# Altium schematic sheet 21 MEMORY_POWER.SchDoc
size 871 x 579 mm
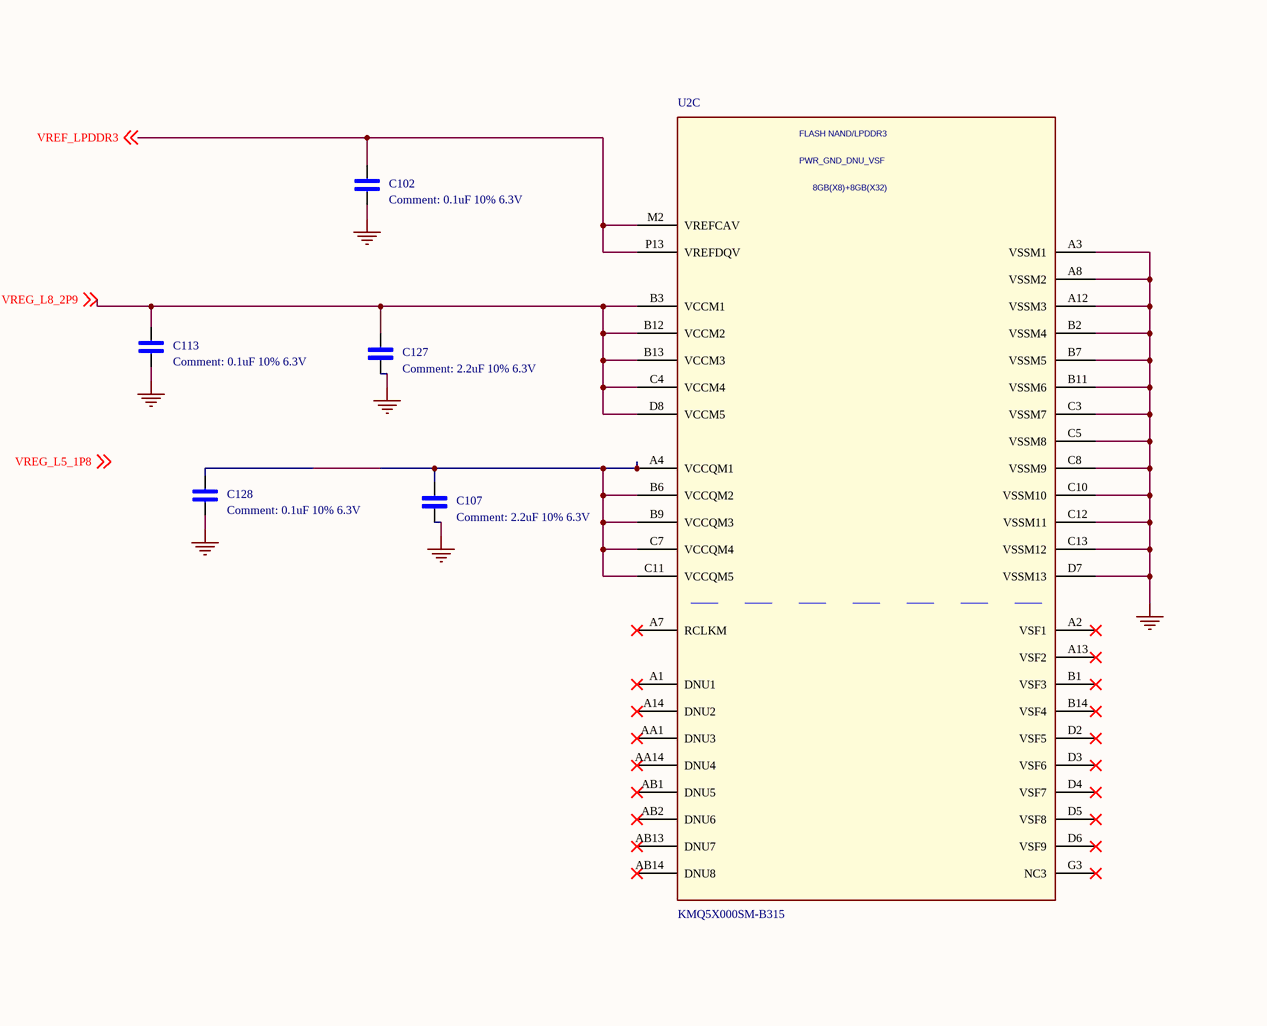
[diagram p0: 21 MEMORY_POWER.SchDoc, top left]
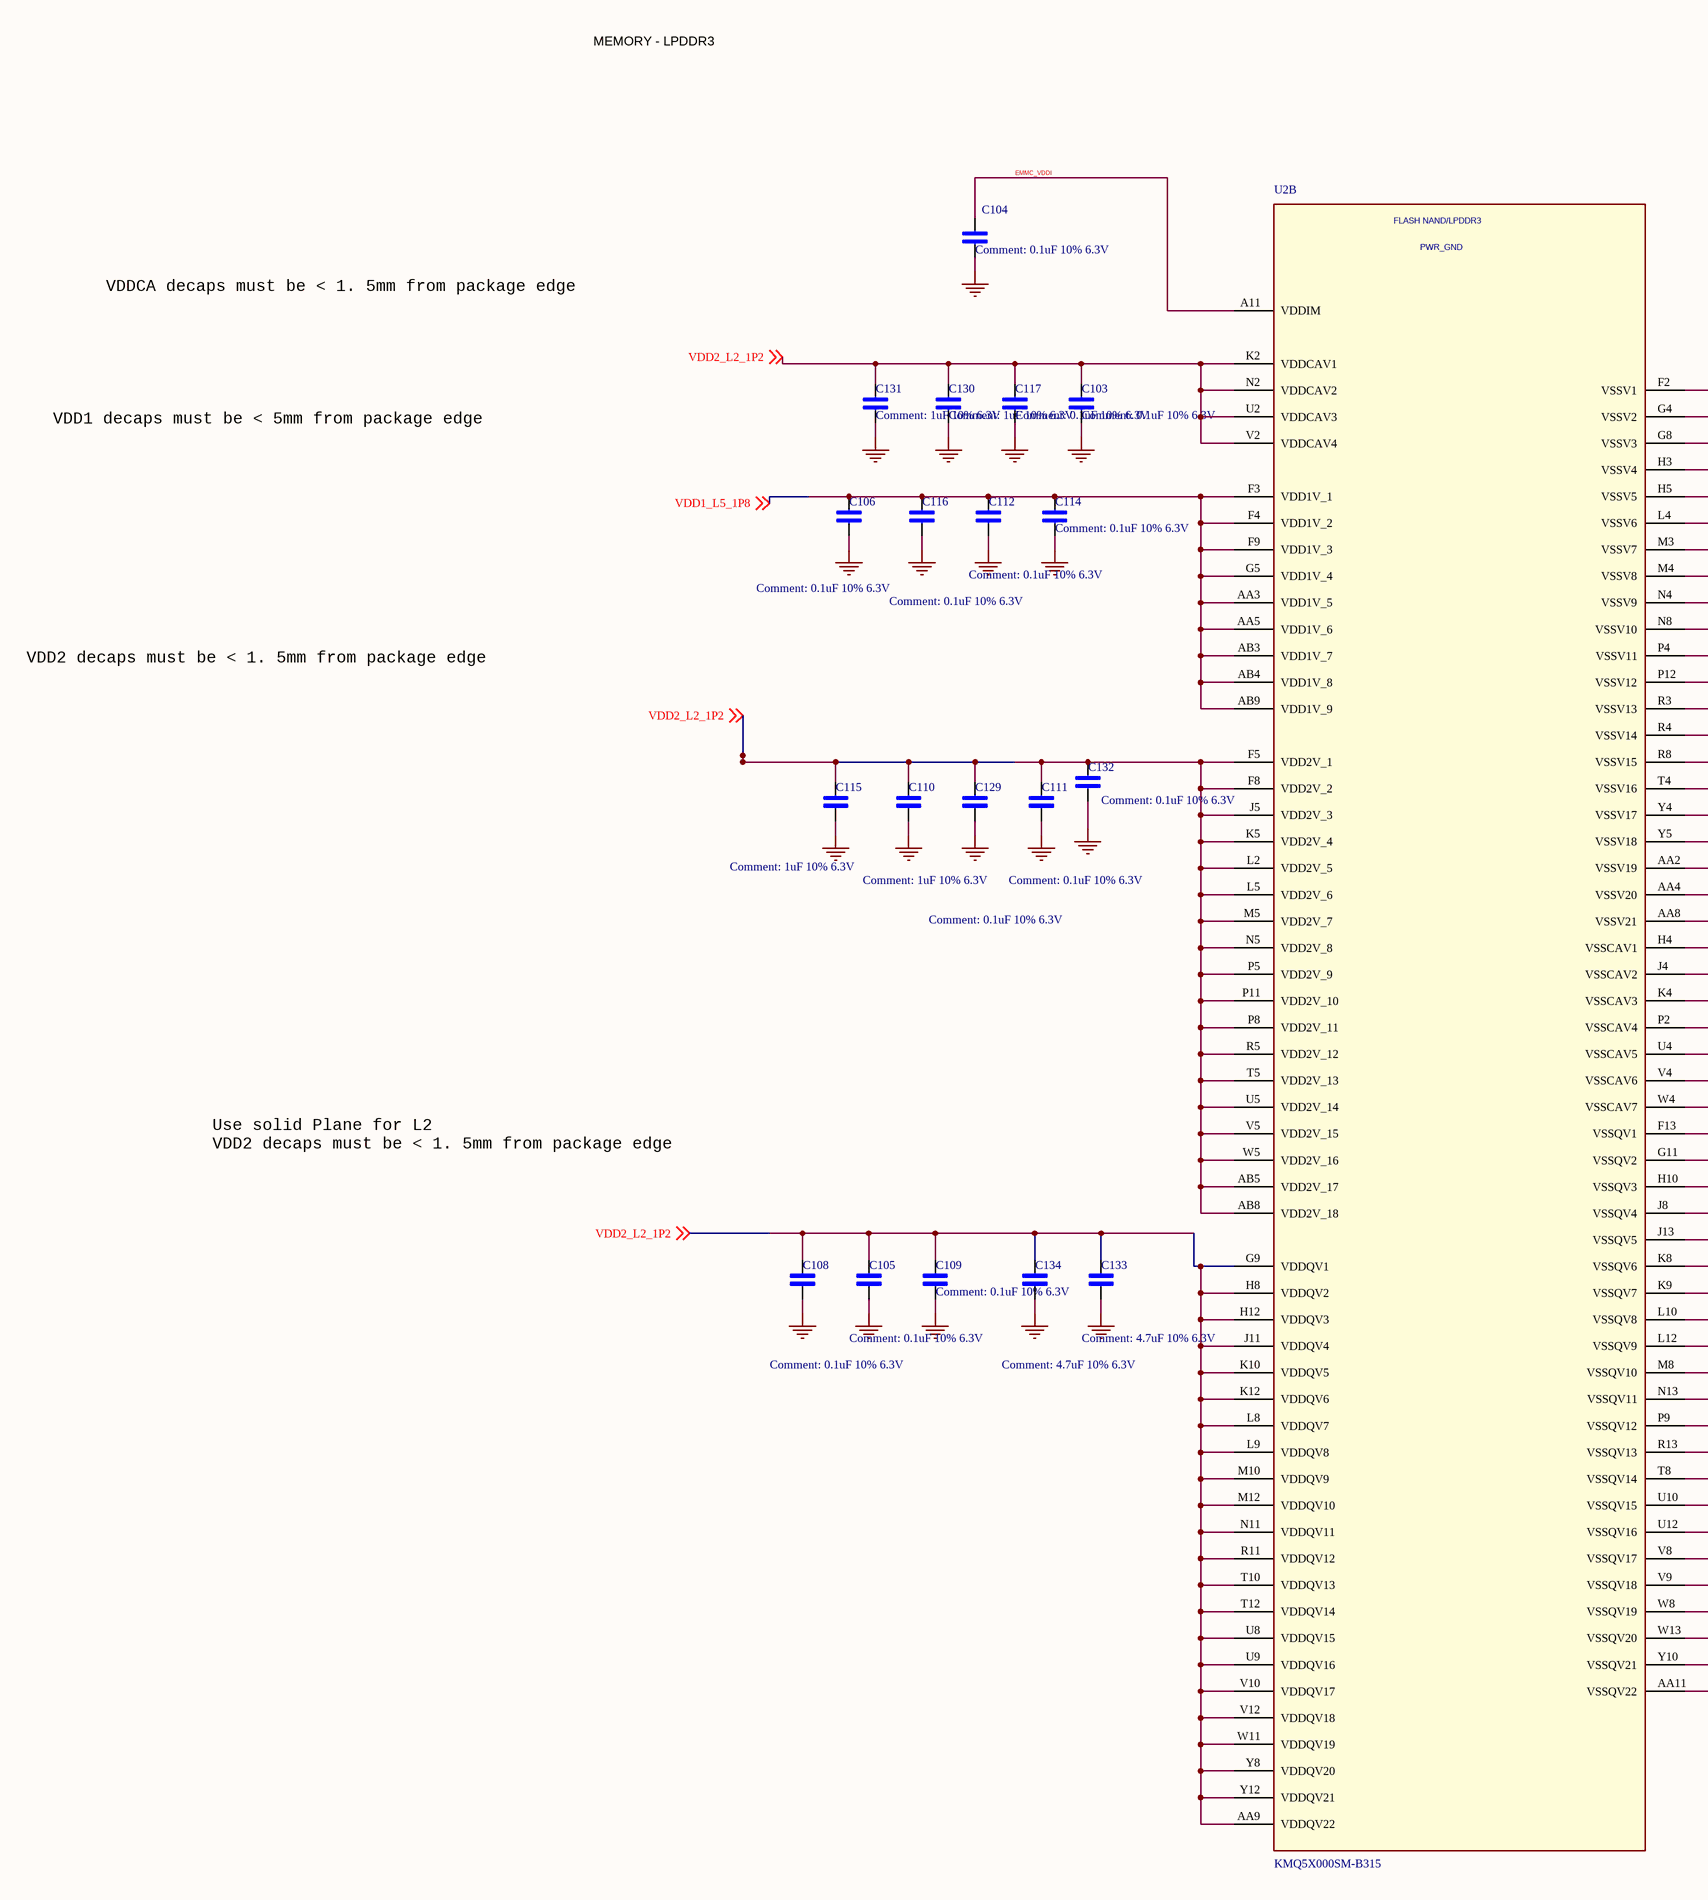
[diagram p1: 21 MEMORY_POWER.SchDoc, top middle]
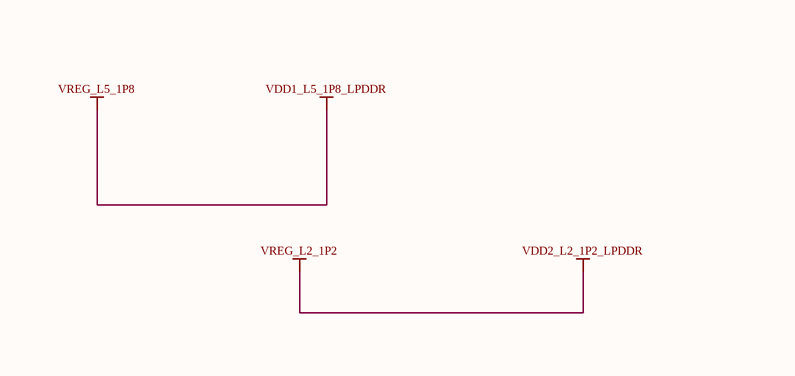
[diagram p2: 21 MEMORY_POWER.SchDoc, bottom left]
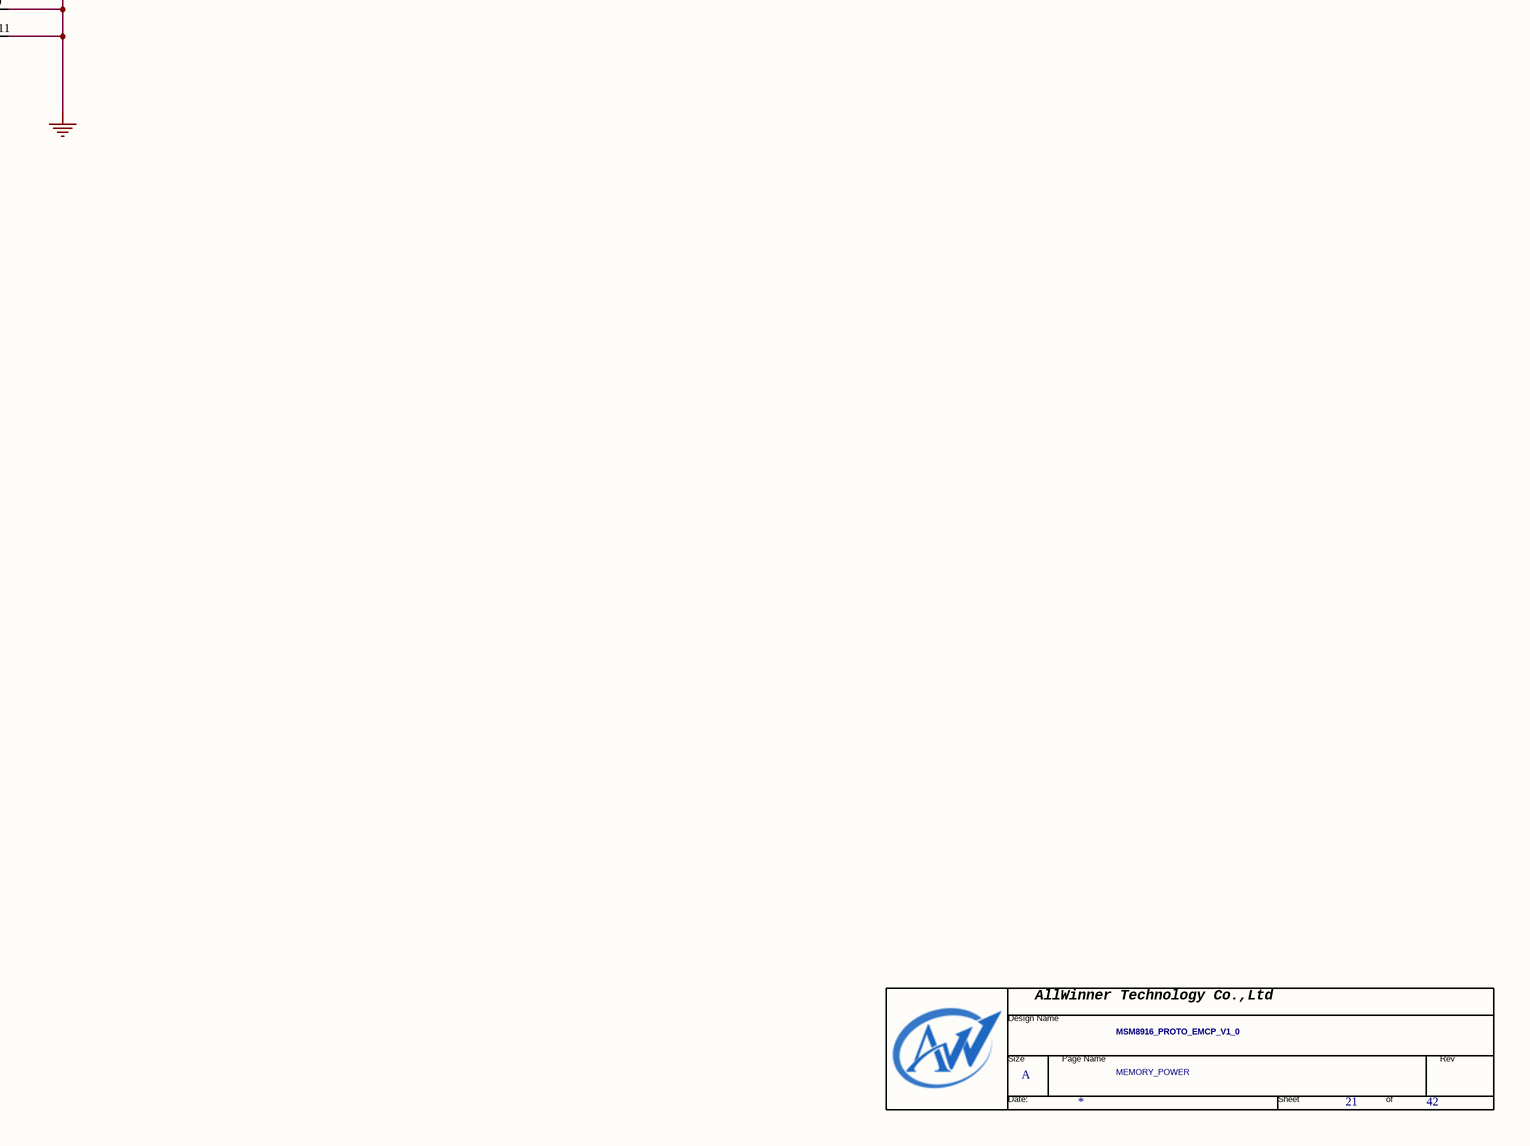
[diagram p3: 21 MEMORY_POWER.SchDoc, bottom right]

## Parts
*  Page Count: 42  Page Number: 21  Page Size: A  Title: MSM8916_PROTO_EMCP_V1_0  Doc: MEMORY_POWER  (hidden comment: TitleBlock0-AW)  (graphical)
C102  0.1uF 10% 6.3V  [c0402]
C103  0.1uF 10% 6.3V  [C0402]
C104  0.1uF 10% 6.3V  [c0402]
C105  0.1uF 10% 6.3V  [C0402]
C106  0.1uF 10% 6.3V  [C0402]
C107  2.2uF 10% 6.3V  [c0402]
C108  0.1uF 10% 6.3V  [C0402]
C109  0.1uF 10% 6.3V  [C0402]
C110  1uF 10% 6.3V  [C0402]
C111  0.1uF 10% 6.3V  [C0402]
C112  0.1uF 10% 6.3V  [C0402]
C113  0.1uF 10% 6.3V  [c0402]
C114  0.1uF 10% 6.3V  [C0402]
C115  1uF 10% 6.3V  [C0402]
C116  0.1uF 10% 6.3V  [C0402]
C117  0.1uF 10% 6.3V  [C0402]
C127  2.2uF 10% 6.3V  [c0402]
C128  0.1uF 10% 6.3V  [c0402]
C129  0.1uF 10% 6.3V  [C0402]
C130  1uF 10% 6.3V  [C0402]
C131  1uF 10% 6.3V  [C0402]
C132  0.1uF 10% 6.3V  [C0402]
C133  4.7uF 10% 6.3V  [C0402]
C134  4.7uF 10% 6.3V  [C0402]
U2  KMQ5X000SM-B315  [KMQ5X000SM-B315]  (parts B,C of 3)

## Nets
GND: C102.2(PIN2) C103.2(PIN2) C104.2(PIN2) C105.2(PIN2) C106.2(PIN2) C107.2(PIN2) C108.2(PIN2) C109.2(PIN2) C110.2(PIN2) C111.2(PIN2) C112.2(PIN2) C113.2(PIN2) C114.2(PIN2) C115.2(PIN2) C116.2(PIN2) C117.2(PIN2) C127.2(PIN2) C128.2(PIN2) C129.2(PIN2) C130.2(PIN2) C131.2(PIN2) C132.2(PIN2) C133.2(PIN2) C134.2(PIN2) U2.A3(VSSM1) U2.A8(VSSM2) U2.A12(VSSM3) U2.AA2(VSSV19) U2.AA4(VSSV20) U2.AA8(VSSV21) U2.AA11(VSSQV22) U2.B2(VSSM4) U2.B7(VSSM5) U2.B11(VSSM6) U2.C3(VSSM7) U2.C5(VSSM8) U2.C8(VSSM9) U2.C10(VSSM10) U2.C12(VSSM11) U2.C13(VSSM12) U2.D7(VSSM13) U2.F2(VSSV1) U2.F13(VSSQV1) U2.G4(VSSV2) U2.G8(VSSV3) U2.G11(VSSQV2) U2.H3(VSSV4) U2.H4(VSSCAV1) U2.H5(VSSV5) U2.H10(VSSQV3) U2.J4(VSSCAV2) U2.J8(VSSQV4) U2.J13(VSSQV5) U2.K4(VSSCAV3) U2.K8(VSSQV6) U2.K9(VSSQV7) U2.L4(VSSV6) U2.L10(VSSQV8) U2.L12(VSSQV9) U2.M3(VSSV7) U2.M4(VSSV8) U2.M8(VSSQV10) U2.N4(VSSV9) U2.N8(VSSV10) U2.N13(VSSQV11) U2.P2(VSSCAV4) U2.P4(VSSV11) U2.P9(VSSQV12) U2.P12(VSSV12) U2.R3(VSSV13) U2.R4(VSSV14) U2.R8(VSSV15) U2.R13(VSSQV13) U2.T4(VSSV16) U2.T8(VSSQV14) U2.U4(VSSCAV5) U2.U10(VSSQV15) U2.U12(VSSQV16) U2.V4(VSSCAV6) U2.V8(VSSQV17) U2.V9(VSSQV18) U2.W4(VSSCAV7) U2.W8(VSSQV19) U2.W13(VSSQV20) U2.Y4(VSSV17) U2.Y5(VSSV18) U2.Y10(VSSQV21)
EMMC_VDDI: C104.1(PIN1) U2.A11(VDDIM)
VDD1_L5_1P8: C106.1(PIN1) C112.1(PIN1) C114.1(PIN1) C116.1(PIN1) U2.AA3(VDD1V_5) U2.AA5(VDD1V_6) U2.AB3(VDD1V_7) U2.AB4(VDD1V_8) U2.AB9(VDD1V_9) U2.F3(VDD1V_1) U2.F4(VDD1V_2) U2.F9(VDD1V_3) U2.G5(VDD1V_4) ; off-sheet VDD1_L5_1P8
VDD2_L2_1P2: C103.1(PIN1) C105.1(PIN1) C108.1(PIN1) C109.1(PIN1) C110.1(PIN1) C111.1(PIN1) C115.1(PIN1) C117.1(PIN1) C129.1(PIN1) C130.1(PIN1) C131.1(PIN1) C132.1(PIN1) C133.1(PIN1) C134.1(PIN1) U2.AA9(VDDQV22) U2.AB5(VDD2V_17) U2.AB8(VDD2V_18) U2.F5(VDD2V_1) U2.F8(VDD2V_2) U2.G9(VDDQV1) U2.H8(VDDQV2) U2.H12(VDDQV3) U2.J5(VDD2V_3) U2.J11(VDDQV4) U2.K2(VDDCAV1) U2.K5(VDD2V_4) U2.K10(VDDQV5) U2.K12(VDDQV6) U2.L2(VDD2V_5) U2.L5(VDD2V_6) U2.L8(VDDQV7) U2.L9(VDDQV8) U2.M5(VDD2V_7) U2.M10(VDDQV9) U2.M12(VDDQV10) U2.N2(VDDCAV2) U2.N5(VDD2V_8) U2.N11(VDDQV11) U2.P5(VDD2V_9) U2.P8(VDD2V_11) U2.P11(VDD2V_10) U2.R5(VDD2V_12) U2.R11(VDDQV12) U2.T5(VDD2V_13) U2.T10(VDDQV13) U2.T12(VDDQV14) U2.U2(VDDCAV3) U2.U5(VDD2V_14) U2.U8(VDDQV15) U2.U9(VDDQV16) U2.V2(VDDCAV4) U2.V5(VDD2V_15) U2.V10(VDDQV17) U2.V12(VDDQV18) U2.W5(VDD2V_16) U2.W11(VDDQV19) U2.Y8(VDDQV20) U2.Y12(VDDQV21) ; off-sheet VDD2_L2_1P2
VREF_LPDDR3: C102.1(PIN1) U2.M2(VREFCAV) U2.P13(VREFDQV) ; off-sheet VREF_LPDDR3
VREG_L8_2P9: C113.1(PIN1) C127.1(PIN1) U2.B3(VCCM1) U2.B12(VCCM2) U2.B13(VCCM3) U2.C4(VCCM4) U2.D8(VCCM5) ; off-sheet VREG_L8_2P9
NetC107_1: C107.1(PIN1) C128.1(PIN1) U2.A4(VCCQM1) U2.B6(VCCQM2) U2.B9(VCCQM3) U2.C7(VCCQM4) U2.C11(VCCQM5)

Not connected (* = marked no-connect by the designer): U2 A1(DNU1)* A2(VSF1)* A7(RCLKM)* A13(VSF2)* A14(DNU2)* AA1(DNU3)* AA14(DNU4)* AB1(DNU5)* AB2(DNU6)* AB13(DNU7)* AB14(DNU8)* B1(VSF3)* B14(VSF4)* D2(VSF5)* D3(VSF6)* D4(VSF7)* D5(VSF8)* D6(VSF9)* G3(NC3)*

## Notes on the sheet
- MEMORY - LPDDR3
- VDDCA decaps must be < 1. 5mm from package edge
- VDD1 decaps must be < 5mm from package edge
- VDD2 decaps must be < 1. 5mm from package edge
- Use solid Plane for L2
  VDD2 decaps must be < 1. 5mm from package edge
- Labels drawn without touching a wire or pin: VREG_L5_1P8
- (in symbol KMQ5X000SM-B315, part B) FLASH NAND/LPDDR3; PWR_GND
- (in symbol KMQ5X000SM-B315, part C) FLASH NAND/LPDDR3; PWR_GND_DNU_VSF; 8GB(X8)+8GB(X32)
- (in symbol TitleBlock0-AW) AllWinner Technology Co.,Ltd; Design Name; Size; Page Name; Rev; Date:; Sheet; of

## Library data of the parts
C102 C104 C107 C113 C127 C128 = C0201
C103 C105 C106 C108-C112 C114-C117 C129-C134 = C0402
* = TitleBlock0-AW: RevCode: ?; Page Create Date: March  8, 1995; Page Modify Date: *